# Altium project HYBRID_SENSOR_OF_THE_WAY_2.PrjPcb
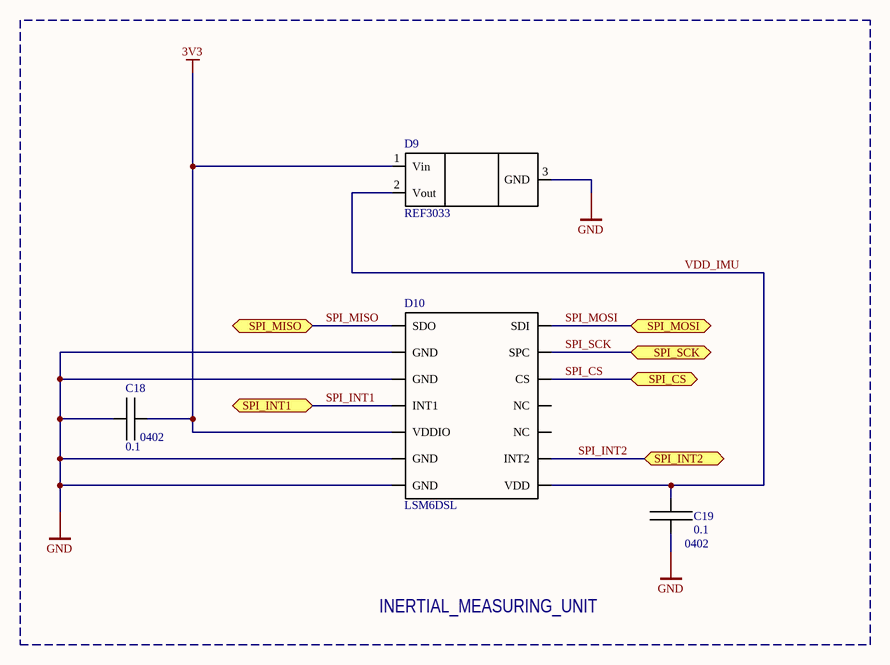
[diagram p0: 3d_gyroscope.SchDoc]
5 sheets, 72 parts. Net scope: flat (ports and power ports of the same name join across sheets).
Board file: HSOW2.PcbDoc
Sheets:
  3d_gyroscope.SchDoc
  Controller.SchDoc
  Controller_power.SchDoc
  RS485_INTERFACE.SchDoc
  Input_output_Connectors.SchDoc

## Sheet 3d_gyroscope.SchDoc
size A4

### Parts
C18  0.1  [SMD_0402_C]
C19  0.1  [SMD_0402_C]
D9  REF3033  [SOT23-3L]
D10  LSM6DSL  [LGA14C50P5X4_300X250X86]

### Ports
SPI_CS, SPI_INT1, SPI_INT2, SPI_MISO, SPI_MOSI, SPI_SCK

### Nets
3V3: C18.2 D9.1(Vin) D10.5(VDDIO)
GND: C18.1 C19.1 D9.3(GND) D10.2(GND) D10.3(GND) D10.6(GND) D10.7(GND)
SPI_CS: D10.12(CS) ; port SPI_CS
SPI_INT1: D10.4(INT1) ; port SPI_INT1
SPI_INT2: D10.9(INT2) ; port SPI_INT2
SPI_MISO: D10.1(SDO) ; port SPI_MISO
SPI_MOSI: D10.14(SDI) ; port SPI_MOSI
SPI_SCK: D10.13(SPC) ; port SPI_SCK
VDD_IMU: C19.2 D9.2(Vout) D10.8(VDD)

Not connected (* = marked no-connect by the designer): D10 10(NC) 11(NC)

### Notes on the sheet
- (near C18) 0402
- (near C19) 0402
- INERTIAL_MEASURING_UNIT

### Library data of the parts
C18 C19 = Capacitor
D9 = REF3033: VOLTAGE STATIC SOURCE 3.3V
D10 = LSM6DSL: 3D accelerometer and 3D gyroscope

## Sheet Controller.SchDoc: Controller
size A4; Organization: ЗАО "ПИК Прогресс"; Revision: 1.0; SheetNumber: 1; PageSetup: Record=PageOptions|CenterHorizontal=True|CenterVertical=True|PrintScale=0.94|XCorrection=1.00|YCorrection=1.00|PrintKind=1|BorderSize=5000000|LeftOffset=0|BottomOffset=0|Orientation=1|PaperLength=1000|PaperWidth=1000|Scale=100|PaperSource=7|PrintQuality=-4|MediaType=1|DitherType=10|PaperKind=A4|PrintScaleMode=1; DecimalNumber: Децимальный номер; HeadOfSector: Нач. сектора; MainDevice: Перв.примен.; Name: Наименование; Scale: 1:1; DocumentType: Схема электрическая принципиальная; FirstReferrence: АБВГ.123456.001; ProjectName: Магнитный датчик
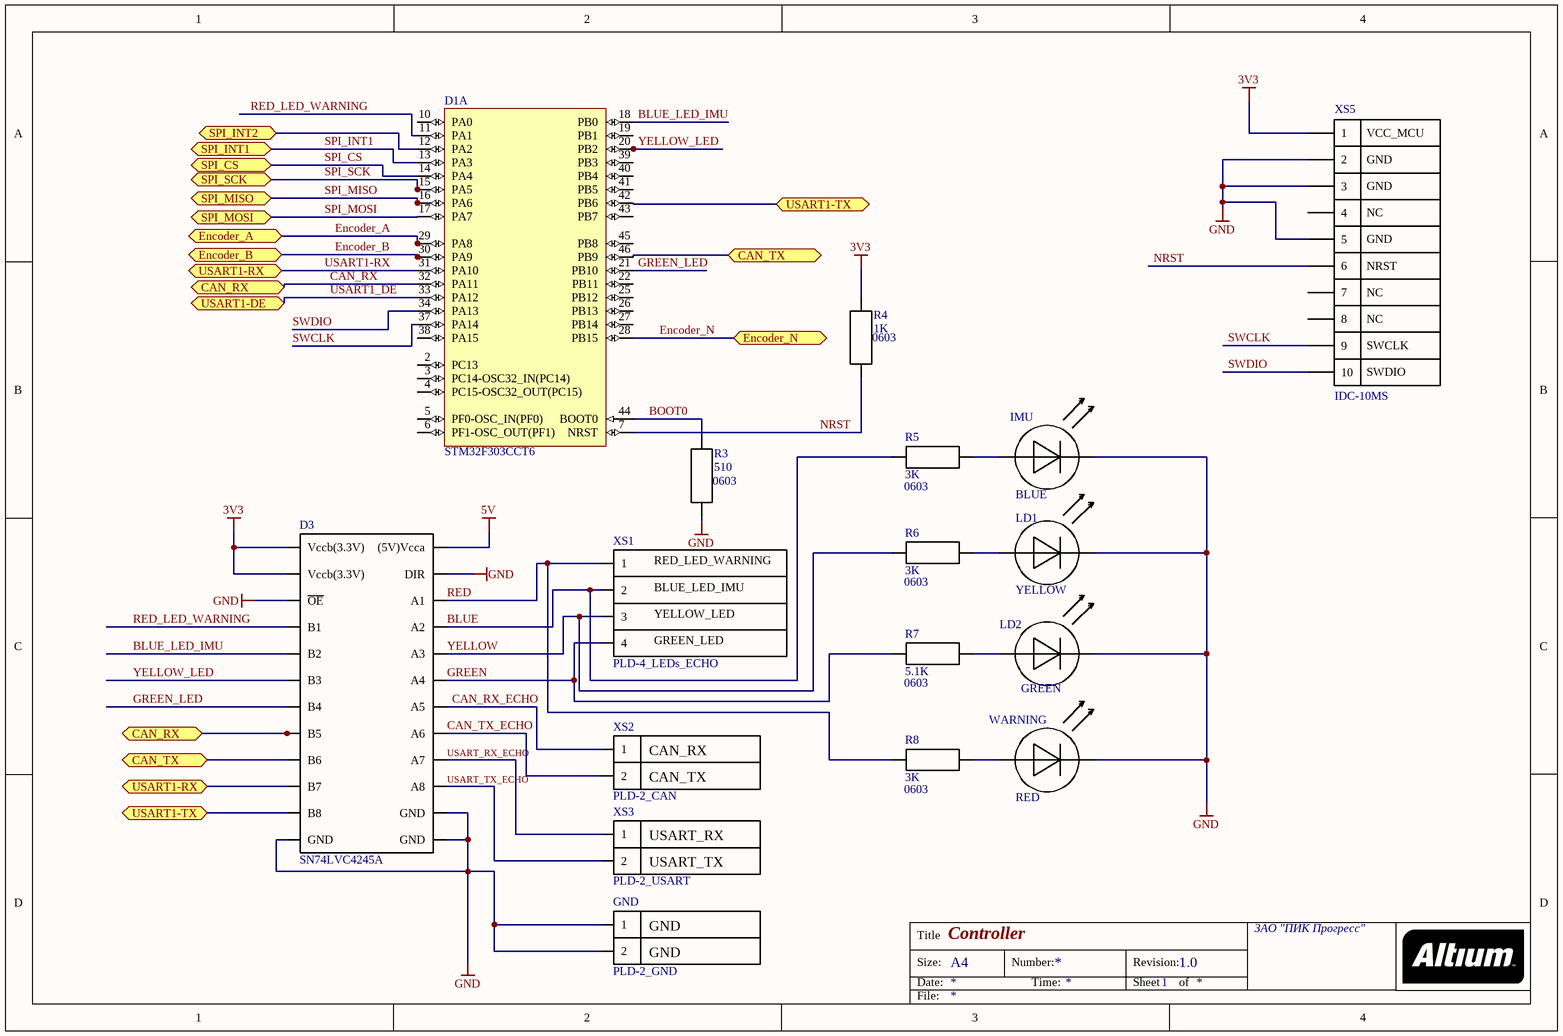
[diagram p1: Controller.SchDoc]

### Parts
D1  STM32F303CCT6  [STM-LQFP48_N]  (part A of 2)
D3  SN74LVC4245A  [SOIC_24_DW(R-PDSO-G24)]
GND  PLD-2_GND  [PLS_2_simple]
IMU  BLUE  [SMD_LED_3216]
LD1  YELLOW  [SMD_LED]
LD2  GREEN  [SMD_LED]
R3  510  [SMD_0603]
R4  1K  [SMD_0603]
R5  3K  [SMD_0603]
R6  3K  [SMD_0603]
R7  5.1K  [SMD_0603]
R8  3K  [SMD_0603]
WARNING  RED  [SMD_LED]
XS1  PLD-4_LEDs_ECHO  [PLS_4]
XS2  PLD-2_CAN  [PLS_2_simple]
XS3  PLD-2_USART  [PLS_2_simple]
XS5  IDC-10MS  [IDC-10MS]

### Ports
CAN_RX, CAN_TX, Encoder_A, Encoder_B, Encoder_N, SPI_CS, SPI_INT1, SPI_INT2, SPI_MISO, SPI_MOSI, SPI_SCK, USART1-DE, USART1-RX, USART1-TX

### Nets
3V3: D3.23(Vccb(3.3V)) D3.24(Vccb(3.3V)) R4.2 XS5.1
5V: D3.1((5V)Vcca)
GND: D3.2(DIR) D3.11(GND) D3.12(GND) D3.13(GND) D3.22(~{OE}) GND.1 GND.2 IMU.1 LD1.1 LD2.1 R3.1 WARNING.1 XS5.2 XS5.3 XS5.5
BLUE: D3.4(A2) R5.1 XS1.2
BLUE_LED_IMU: D1.18(PB0) D3.20(B2)
BOOT0: D1.44(BOOT0) R3.2
CAN_RX: D1.32(PA11) D3.17(B5) ; port CAN_RX
CAN_RX_ECHO: D3.7(A5) XS2.1
CAN_TX: D1.46(PB9) D3.16(B6) ; port CAN_TX
CAN_TX_ECHO: D3.8(A6) XS2.2
Encoder_A: D1.29(PA8) ; port Encoder_A
Encoder_B: D1.30(PA9) ; port Encoder_B
Encoder_N: D1.28(PB15) ; port Encoder_N
GREEN: D3.6(A4) R7.1 XS1.4
GREEN_LED: D1.21(PB10) D3.18(B4)
NRST: D1.7(NRST) R4.1 XS5.6
RED: D3.3(A1) R8.1 XS1.1
RED_LED_WARNING: D1.11(PA1) D3.21(B1)
SPI_CS: D1.14(PA4) ; port SPI_CS
SPI_INT1: D1.13(PA3) ; port SPI_INT1
SPI_INT2: D1.12(PA2) ; port SPI_INT2
SPI_MISO: D1.16(PA6) ; port SPI_MISO
SPI_MOSI: D1.17(PA7) ; port SPI_MOSI
SPI_SCK: D1.15(PA5) ; port SPI_SCK
SWCLK: D1.37(PA14) XS5.9
SWDIO: D1.34(PA13) XS5.10
USART1-RX: D1.31(PA10) D3.15(B7) ; port USART1-RX
USART1-TX: D1.42(PB6) D3.14(B8) ; port USART1-TX
USART1_DE: D1.33(PA12) ; port USART1-DE
USART_RX_ECHO: D3.9(A7) XS3.1
USART_TX_ECHO: D3.10(A8) XS3.2
YELLOW: D3.5(A3) R6.1 XS1.3
YELLOW_LED: D1.20(PB2) D3.19(B3)
NetIMU_2: IMU.2 R5.2
NetLD1_2: LD1.2 R6.2
NetLD2_2: LD2.2 R7.2
NetR8_2: R8.2 WARNING.2

Not connected (* = marked no-connect by the designer): D1 2(PC13) 3(PC14-OSC32_IN(PC14)) 4(PC15-OSC32_OUT(PC15)) 5(PF0-OSC_IN(PF0)) 6(PF1-OSC_OUT(PF1)) 10(PA0) 19(PB1) 22(PB11) 25(PB12) 26(PB13) 27(PB14) 38(PA15) 39(PB3) 40(PB4) 41(PB5) 43(PB7) 45(PB8); XS5 4 7 8

### Notes on the sheet
- (near R4) 0603
- (near R3) 0603
- (near R5) 0603
- (near R6) 0603
- (near R7) 0603
- (near R8) 0603
- Title
- Size:
- Date:
- A4
- Number:
- Time:
- Revision:
- Sheet
- of
- File:
- (in symbol IDC-10MS) VCC_MCU; GND; NC; NRST; SWCLK; SWDIO
- (in symbol PLD-2_CAN) CAN_RX; CAN_TX
- (in symbol PLD-2_USART) USART_RX; USART_TX
- (in symbol PLD-4_LEDs_ECHO) RED_LED_WARNING; BLUE_LED_IMU; YELLOW_LED; GREEN_LED

### Library data of the parts
D1 = STM32F303CCT6: ARM Cortex-M4 32-bit MCU, 256 KB Flash, 40 KB Internal RAM, 37 I/Os, 48-pin LQFP, -40 to 85 degC, Tray; D/A Converter: 2x12-bit (2 Channel); FLASH Size (Prog) (kB): 256; I/Os (High Current): 37; Internal RAM Size (kB): 40; Operating Frequency(F) (Processor speed) (MHz): 72; Supply Voltage(Vcc) min (V): 2; DatasheetVersion: Rev. 6; PackageVersion: Rev. 6, 06/2013; PackageReference: LQFP48; PackageDescription: 48-Pin Low Profile Quad Flat Package, 7 x 7 mm Body, 0.5 mm Pitch; Supplier 1: Digi-Key; Supplier Part Number 1: 497-13318-ND; Supplier 2: Newark; Supplier Part Number 2: 46W2192; Supplier 3: Newark; Supplier Part Number 3: 66W7286; Supplier 4: Mouser; Supplier Part Number 4: 511-STM32F303CCT6; Core: ARM Cortex-M4; Packing: Tray; Mounting Technology: Surface Mount; PartNumber: STM32F303CCT6; ComponentLink1Description: Manufacturer URL; ComponentLink1URL: http://www.st.com/web/en/home.html; ComponentLink2Description: Datasheet; ComponentLink2URL: http://www.st.com/st-web-ui/static/active/en/resource/technical/document/datasheet/DM00058181.pdf; ComponentLink3Description: Package Specification; ComponentLink3URL: http://www.st.com/st-web-ui/static/active/en/resource/technical/document/datasheet/DM00058181.pdf
D3 = SN74LVC4245A: optic bus transiever with 3-state
IMU LD1 LD2 WARNING = LED_Diode
R3-R8 = Resistor

## Sheet Controller_power.SchDoc
size A4
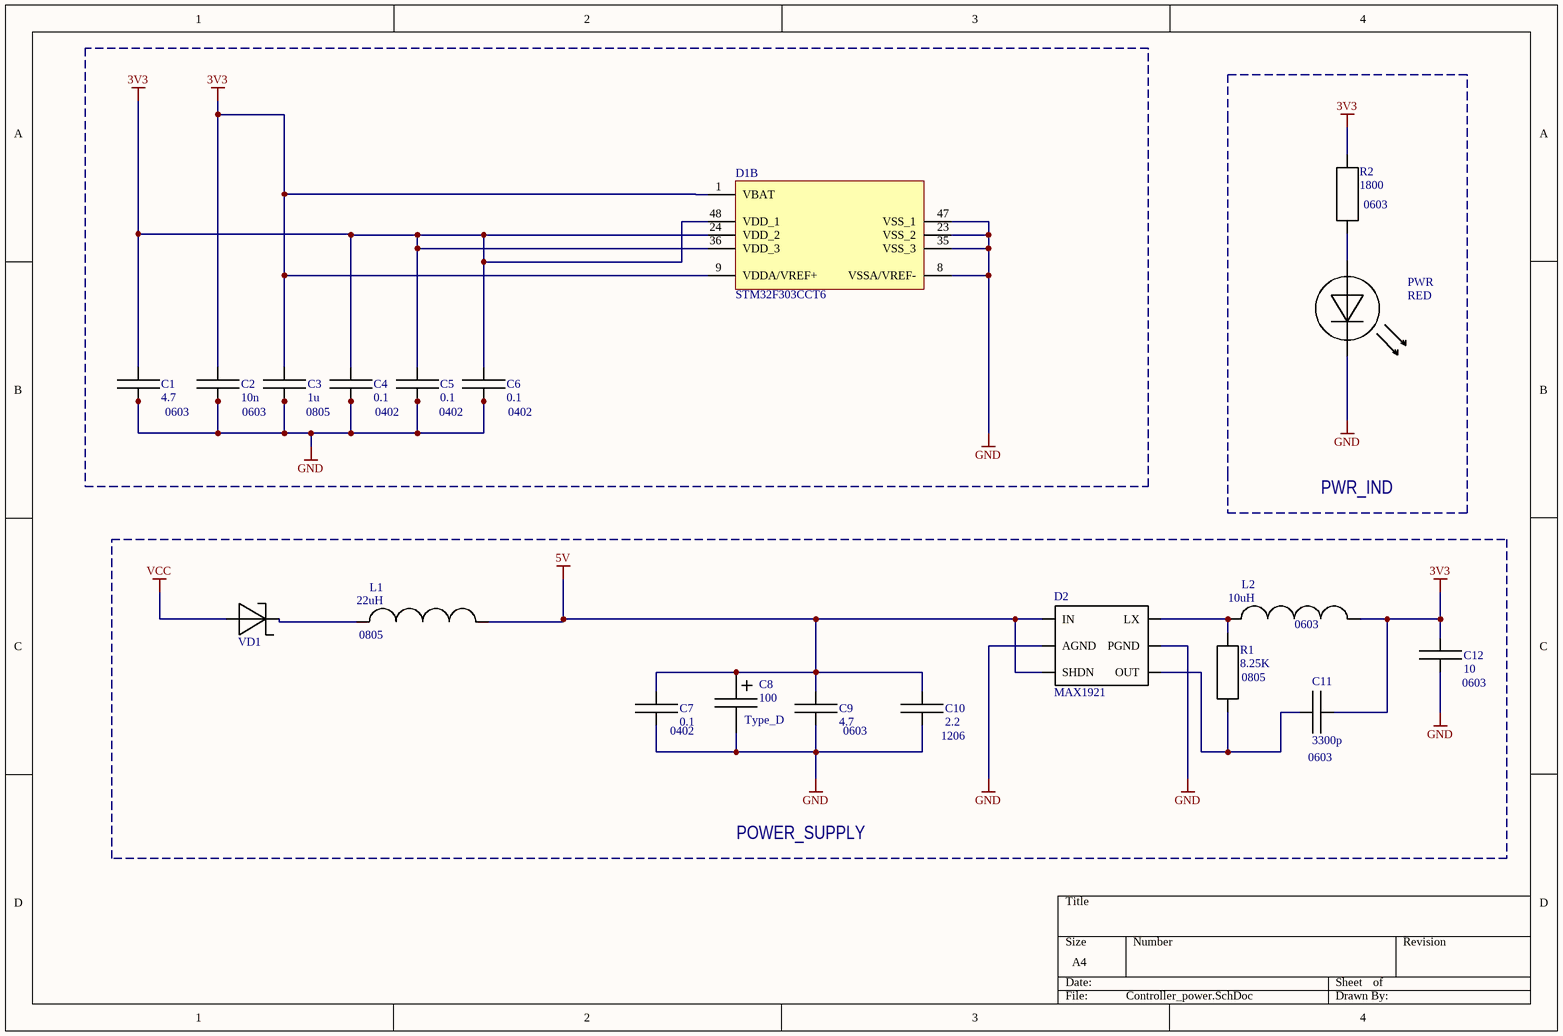
[diagram p2: Controller_power.SchDoc]

### Parts
C1  4.7  [SMD_0603_C]
C2  10n  [SMD_0603_C]
C3  1u  [SMD_0805]
C4  0.1  [SMD_0402_C]
C5  0.1  [SMD_0402_C]
C6  0.1  [SMD_0402_C]
C7  0.1  [SMD_0402_C]
C8  100  [SMD_7343]
C9  4.7  [SMD_0603_C]
C10  2.2  [SMD_1206]
C11  3300p  [SMD_0603_C]
C12  10  [SMD_0603_C]
D1  STM32F303CCT6  [STM-LQFP48_N]  (part B of 2)
D2  MAX1921  [SOT23(95P280X145-6N)]
L1  22uH  [SMD_0805]
L2  10uH  [SMD_0603]
PWR  RED  [SMD_LED]
R1  8.25K  [SMD_0805]
R2  1800  [SMD_0603]
VD1  Diode_schottky  [SOD_123]  (value not drawn)

### Blocks framed on the sheet
PWR_IND: PWR R2
POWER_SUPPLY: C7-C12 D2 L1 L2 R1 VD1

### Nets
3V3: C1.2 C2.2 C3.2 C4.2 C5.2 C6.2 C11.2 C12.2 D1.1(VBAT) D1.9(VDDA/VREF+) D1.24(VDD_2) D1.36(VDD_3) D1.48(VDD_1) L2.2 R2.2
5V: C7.2 C8.1 C9.2 C10.2 D2.1(IN) D2.3(SHDN) L1.2
GND: C1.1 C2.1 C3.1 C4.1 C5.1 C6.1 C7.1 C8.2 C9.1 C10.1 C12.1 D1.8(VSSA/VREF-) D1.23(VSS_2) D1.35(VSS_3) D1.47(VSS_1) D2.2(AGND) D2.5(PGND) PWR.1
VCC: VD1.1
NetC11_1: C11.1 D2.4(OUT) R1.1
NetD2_6: D2.6(LX) L2.1 R1.2
NetL1_1: L1.1 VD1.2
NetPWR_2: PWR.2 R2.1

### Notes on the sheet
- (near R2) 0603
- 0603
- 0805
- 0402
- (near C6) 0402
- (near L1) 0805
- (near L2) 0603
- (near R1) 0805
- (near C12) 0603
- (near C7) 0402
- (near C8) Type_D
- (near C9) 0603
- (near C10) 1206
- (near C11) 0603

### Library data of the parts
C1-C7 C9-C12 = Capacitor
C8 = Capacitor polar
D1 = STM32F303CCT6: as D1 on sheet Controller; DatasheetVersion: Rev. 6; PackageVersion: Rev. 6, 06/2013; PackageReference: LQFP48; PackageDescription: 48-Pin Low Profile Quad Flat Package, 7 x 7 mm Body, 0.5 mm Pitch; Supplier 1: Digi-Key; Supplier Part Number 1: 497-13318-ND; Supplier 2: Newark; Supplier Part Number 2: 46W2192; Supplier 3: Newark; Supplier Part Number 3: 66W7286; Supplier 4: Mouser; Supplier Part Number 4: 511-STM32F303CCT6; Core: ARM Cortex-M4; Packing: Tray; Mounting Technology: Surface Mount; PartNumber: STM32F303CCT6; ComponentLink1Description: Manufacturer URL; ComponentLink1URL: http://www.st.com/web/en/home.html; ComponentLink2Description: Datasheet; ComponentLink2URL: http://www.st.com/st-web-ui/static/active/en/resource/technical/document/datasheet/DM00058181.pdf; ComponentLink3Description: Package Specification; ComponentLink3URL: http://www.st.com/st-web-ui/static/active/en/resource/technical/document/datasheet/DM00058181.pdf
L1 L2 = Inductor
PWR = LED_Diode
R1 = Resistor
R2 = Resistor: 0603 resistor

## Sheet RS485_INTERFACE.SchDoc
size A4
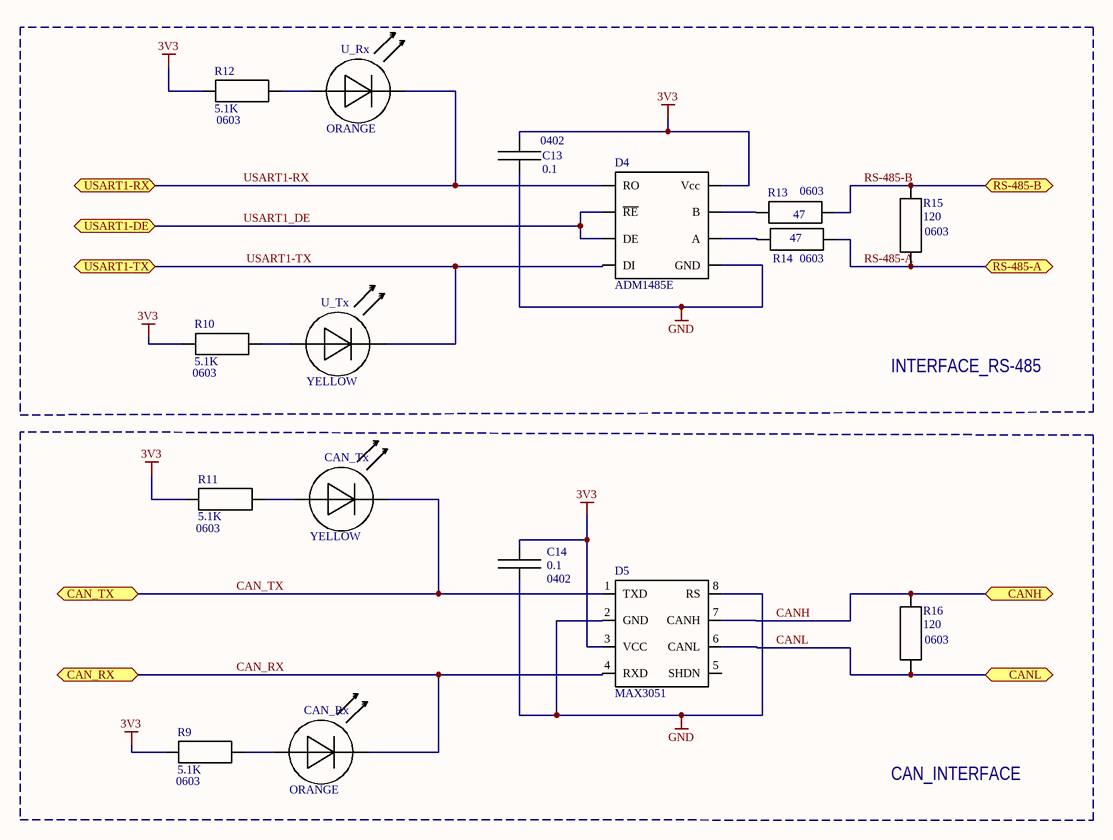
[diagram p3: RS485_INTERFACE.SchDoc]

### Parts
C13  0.1  [SMD_0402_C]
C14  0.1  [SMD_0402_C]
CAN_Rx  ORANGE  [SMD_LED_2012]
CAN_Tx  YELLOW  [SMD_LED]
D4  ADM1485E  [SOIC_N 8-Lead]
D5  MAX3051  [SOIC_N 8-Lead]
R9  5.1K  [SMD_0603]
R10  5.1K  [SMD_0603]
R11  5.1K  [SMD_0603]
R12  5.1K  [SMD_0603]
R13  47  [SMD_0603]
R14  47  [SMD_0603]
R15  120  [SMD_0603]
R16  120  [SMD_0603]
U_Rx  ORANGE  [SMD_LED_2012]
U_Tx  YELLOW  [SMD_LED]

### Blocks framed on the sheet
INTERFACE_RS-485: C13 D4 R10 R12-R15 U_Rx U_Tx
CAN_INTERFACE: C14 CAN_Rx CAN_Tx D5 R9 R11 R16

### Ports
CAN_RX, CAN_TX, CANH, CANL, RS-485-A, RS-485-B, USART1-DE, USART1-RX, USART1-TX

### Nets
3V3: C13.2 C14.2 D4.8(Vcc) D5.3(VCC) R9.1 R10.1 R11.1 R12.1
GND: C13.1 C14.1 D4.5(GND) D5.2(GND) D5.8(RS)
CAN_RX: CAN_Rx.1 D5.4(RXD) ; port CAN_RX
CAN_TX: CAN_Tx.1 D5.1(TXD) ; port CAN_TX
CANH: D5.7(CANH) R16.2 ; port CANH
CANL: D5.6(CANL) R16.1 ; port CANL
RS-485-A: R14.2 R15.1 ; port RS-485-A
RS-485-B: R13.2 R15.2 ; port RS-485-B
USART1-RX: D4.1(RO) U_Rx.1 ; port USART1-RX
USART1-TX: D4.4(DI) U_Tx.1 ; port USART1-TX
USART1_DE: D4.2(~{RE}) D4.3(DE) ; port USART1-DE
NetCAN_Rx_2: CAN_Rx.2 R9.2
NetCAN_Tx_2: CAN_Tx.2 R11.2
NetD4_6: D4.6(A) R14.1
NetD4_7: D4.7(B) R13.1
NetR10_2: R10.2 U_Tx.2
NetR12_2: R12.2 U_Rx.2

Not connected (* = marked no-connect by the designer): D5 5(SHDN)

### Notes on the sheet
- (near R12) 0603
- (near C13) 0402
- (near R13) 0603
- (near R14) 0603
- (near R15) 0603
- (near R10) 0603
- (near R11) 0603
- 0402
- (near R16) 0603
- (near R9) 0603

### Library data of the parts
C13 C14 = Capacitor
CAN_Rx CAN_Tx U_Rx U_Tx = LED_Diode
D5 = MAX3051: CAN Transeiver, 3.3V, 1Mbps, 8pin
R9-R12 R16 = Resistor: 0603 resistor
R13-R15 = Resistor

## Sheet Input_output_Connectors.SchDoc
size A4
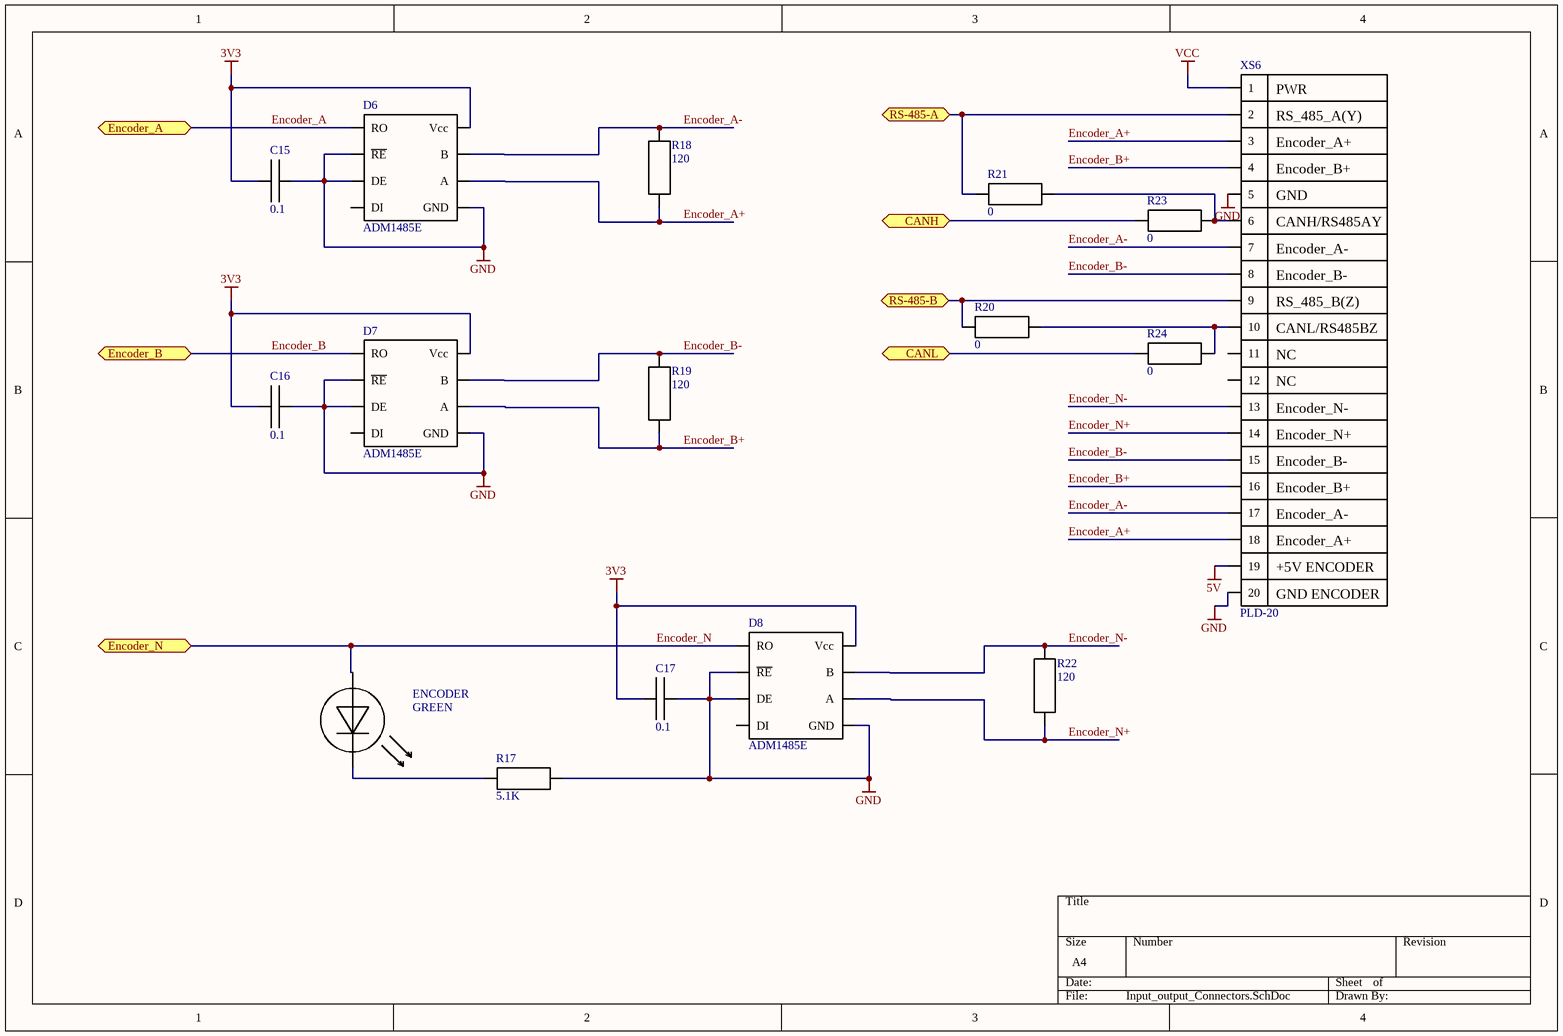
[diagram p4: Input_output_Connectors.SchDoc]

### Parts
C15  0.1  [SMD_0402_C]
C16  0.1  [SMD_0402_C]
C17  0.1  [SMD_0402_C]
D6  ADM1485E  [SOIC_N 8-Lead]
D7  ADM1485E  [SOIC_N 8-Lead]
D8  ADM1485E  [SOIC_N 8-Lead]
ENCODER  GREEN  [SMD_LED]
R17  5.1K  [SMD_0603]
R18  120  [SMD_0603]
R19  120  [SMD_0603]
R20  0  [SMD_0603]
R21  0  [SMD_0603]
R22  120  [SMD_0603]
R23  0  [SMD_0603]
R24  0  [SMD_0603]
XS6  PLD-20  [IDC2.54-20]

### Ports
CANH, CANL, Encoder_A, Encoder_B, Encoder_N, RS-485-A, RS-485-B

### Nets
3V3: C15.1 C16.1 C17.1 D6.8(Vcc) D7.8(Vcc) D8.8(Vcc)
5V: XS6.19
GND: C15.2 C16.2 C17.2 D6.2(~{RE}) D6.3(DE) D6.5(GND) D7.2(~{RE}) D7.3(DE) D7.5(GND) D8.2(~{RE}) D8.3(DE) D8.5(GND) R17.2 XS6.5 XS6.20
VCC: XS6.1
CANH: R23.1 ; port CANH
CANL: R24.1 ; port CANL
Encoder_A: D6.1(RO) ; port Encoder_A
Encoder_A+: D6.6(A) R18.1 XS6.3 XS6.18
Encoder_A-: D6.7(B) R18.2 XS6.7 XS6.17
Encoder_B: D7.1(RO) ; port Encoder_B
Encoder_B+: D7.6(A) R19.1 XS6.4 XS6.16
Encoder_B-: D7.7(B) R19.2 XS6.8 XS6.15
Encoder_N: D8.1(RO) ENCODER.2 ; port Encoder_N
Encoder_N+: D8.6(A) R22.1 XS6.14
Encoder_N-: D8.7(B) R22.2 XS6.13
RS-485-A: R21.1 XS6.2 ; port RS-485-A
RS-485-B: R20.1 XS6.9 ; port RS-485-B
NetENCODER_1: ENCODER.1 R17.1
NetR20_2: R20.2 R24.2 XS6.10
NetR21_2: R21.2 R23.2 XS6.6

Not connected (* = marked no-connect by the designer): D6 4(DI); D7 4(DI); D8 4(DI); XS6 11 12

### Notes on the sheet
- (in symbol PLD-20) PWR; RS_485_A(Y); Encoder_A+; Encoder_B+; GND; CANH/RS485AY; Encoder_A-; Encoder_B-; RS_485_B(Z); CANL/RS485BZ; NC; Encoder_N-; Encoder_N+; +5V ENCODER; GND ENCODER

### Library data of the parts
C15-C17 = Capacitor
D6-D8 = ADM1485
ENCODER = LED_Diode
R17-R19 R22 = Resistor: 0603 resistor
R20 R21 = Resistor: dont fitting
R23 R24 = Resistor
XS6 = PLD-20: HSOW2 encoder and external connector

## Nets that join several sheets
3V3: 3d_gyroscope (C18.2 D9.1 D10.5), Controller (D3.23 D3.24 R4.2 XS5.1), Controller_power (15 pins), RS485_INTERFACE (8 pins), Input_output_Connectors (6 pins)
5V: Controller (D3.1), Controller_power (7 pins), Input_output_Connectors (XS6.19)
GND: 3d_gyroscope (7 pins), Controller (15 pins), Controller_power (18 pins), RS485_INTERFACE (5 pins), Input_output_Connectors (15 pins)
VCC: Controller_power (VD1.1), Input_output_Connectors (XS6.1)
CAN_RX: Controller (D1.32 D3.17), RS485_INTERFACE (CAN_Rx.1 D5.4)
CAN_TX: Controller (D1.46 D3.16), RS485_INTERFACE (CAN_Tx.1 D5.1)
CANH: RS485_INTERFACE (D5.7 R16.2), Input_output_Connectors (R23.1)
CANL: RS485_INTERFACE (D5.6 R16.1), Input_output_Connectors (R24.1)
Encoder_A: Controller (D1.29), Input_output_Connectors (D6.1)
Encoder_B: Controller (D1.30), Input_output_Connectors (D7.1)
Encoder_N: Controller (D1.28), Input_output_Connectors (D8.1 ENCODER.2)
RS-485-A: RS485_INTERFACE (R14.2 R15.1), Input_output_Connectors (R21.1 XS6.2)
RS-485-B: RS485_INTERFACE (R13.2 R15.2), Input_output_Connectors (R20.1 XS6.9)
SPI_CS: 3d_gyroscope (D10.12), Controller (D1.14)
SPI_INT1: 3d_gyroscope (D10.4), Controller (D1.13)
SPI_INT2: 3d_gyroscope (D10.9), Controller (D1.12)
SPI_MISO: 3d_gyroscope (D10.1), Controller (D1.16)
SPI_MOSI: 3d_gyroscope (D10.14), Controller (D1.17)
SPI_SCK: 3d_gyroscope (D10.13), Controller (D1.15)
USART1-RX: Controller (D1.31 D3.15), RS485_INTERFACE (D4.1 U_Rx.1)
USART1-TX: Controller (D1.42 D3.14), RS485_INTERFACE (D4.4 U_Tx.1)
USART1_DE: Controller (D1.33), RS485_INTERFACE (D4.2 D4.3)